# Altium schematic sheet a3_revision_history.SchDoc
size A4; Date: 10/27/2015; Engineer: JBayalas; DocumentNumber: 2; Revision: V1.0; SheetNumber: 2; SheetTotal: 11
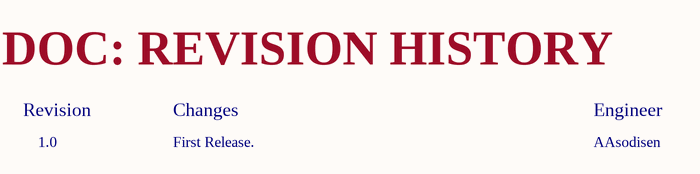
[diagram p0: a3_revision_history.SchDoc]

## Notes on the sheet
- DOC: REVISION HISTORY
- Revision
- 1.0
- Changes
- First Release.
- Engineer
- AAsodisen
- Title:
- Sheet:
- Date:
- of
- Project:
- Revision:
- Engineer:
- Wi4B S.r.l